# Altium schematic sheet SW_DIP8_SMT.SchDoc: 8-Way SPST DIP Switch (SMT)
size A4; DocumentNumber: 47; SheetNumber: 48; SheetTotal: 78
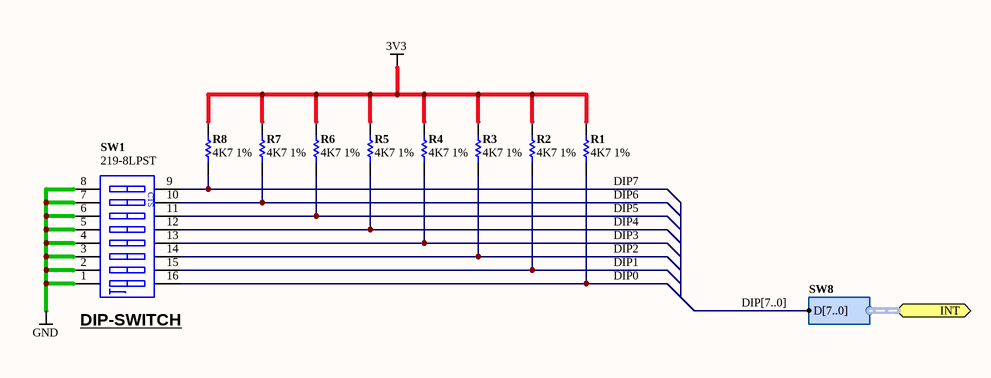
[diagram p0: SW_DIP8_SMT.SchDoc]

## Parts
R1  4K7 1%  [RESC1005-STAR]
R2  4K7 1%  [RESC1005-STAR]
R3  4K7 1%  [RESC1005-STAR]
R4  4K7 1%  [RESC1005-STAR]
R5  4K7 1%  [RESC1005-STAR]
R6  4K7 1%  [RESC1005-STAR]
R7  4K7 1%  [RESC1005-STAR]
R8  4K7 1%  [RESC1005-STAR]
SW1  219-8LPST  [219-8LPST]

## Ports
INT (harness SW8)

## Harnesses
SW8: D[7..0]

## Nets
3V3: R1.2 R2.2 R3.2 R4.2 R5.2 R6.2 R7.2 R8.2
GND: SW1.1(A1) SW1.2(A2) SW1.3(A3) SW1.4(A4) SW1.5(A5) SW1.6(A6) SW1.7(A7) SW1.8(A8)
DIP0: R1.1 SW1.16(B1)
DIP1: R2.1 SW1.15(B2)
DIP2: R3.1 SW1.14(B3)
DIP3: R4.1 SW1.13(B4)
DIP4: R5.1 SW1.12(B5)
DIP5: R6.1 SW1.11(B6)
DIP6: R7.1 SW1.10(B7)
DIP7: R8.1 SW1.9(B8)

## Buses and harness runs
bus DIP[7..0]

## Notes on the sheet
- (near SW1) DIP-SWITCH
- Sheet Title
- Project Title
- Size:
- Date:
- A4
- Assy:
- Time:
- Revision:
- Sheet
- of
- File:
- (in symbol D-301-0018) CTS

## Library data of the parts
R1-R8 = D-100-0088: Resistor, 4K7 1% 0402 (1005); Power Rating: 63 mW; Resistance: 4.7 K; Category: Resistor; Mounting Technology: Surface Mount; Status: Production; Tolerance: 1 %
SW1 = D-301-0018: Switch, SPST, Surface Mount DIP, 8-way; Rated Voltage: 50 V; Switch Type: Dual In Line; Category: Switch; Mounting Technology: Surface Mount; Status: Unreleased